# Altium schematic sheet mcu.SCHDOC: LiveDesign Evaluation - Video Games
size B; Organization: Altium Limited; Address1: L3, 12a Rodborough Rd; Address2: Frenchs Forest; Address3: NSW; Address4: Australia 2086; DocumentNumber: 2; SheetNumber: 2; SheetTotal: 13
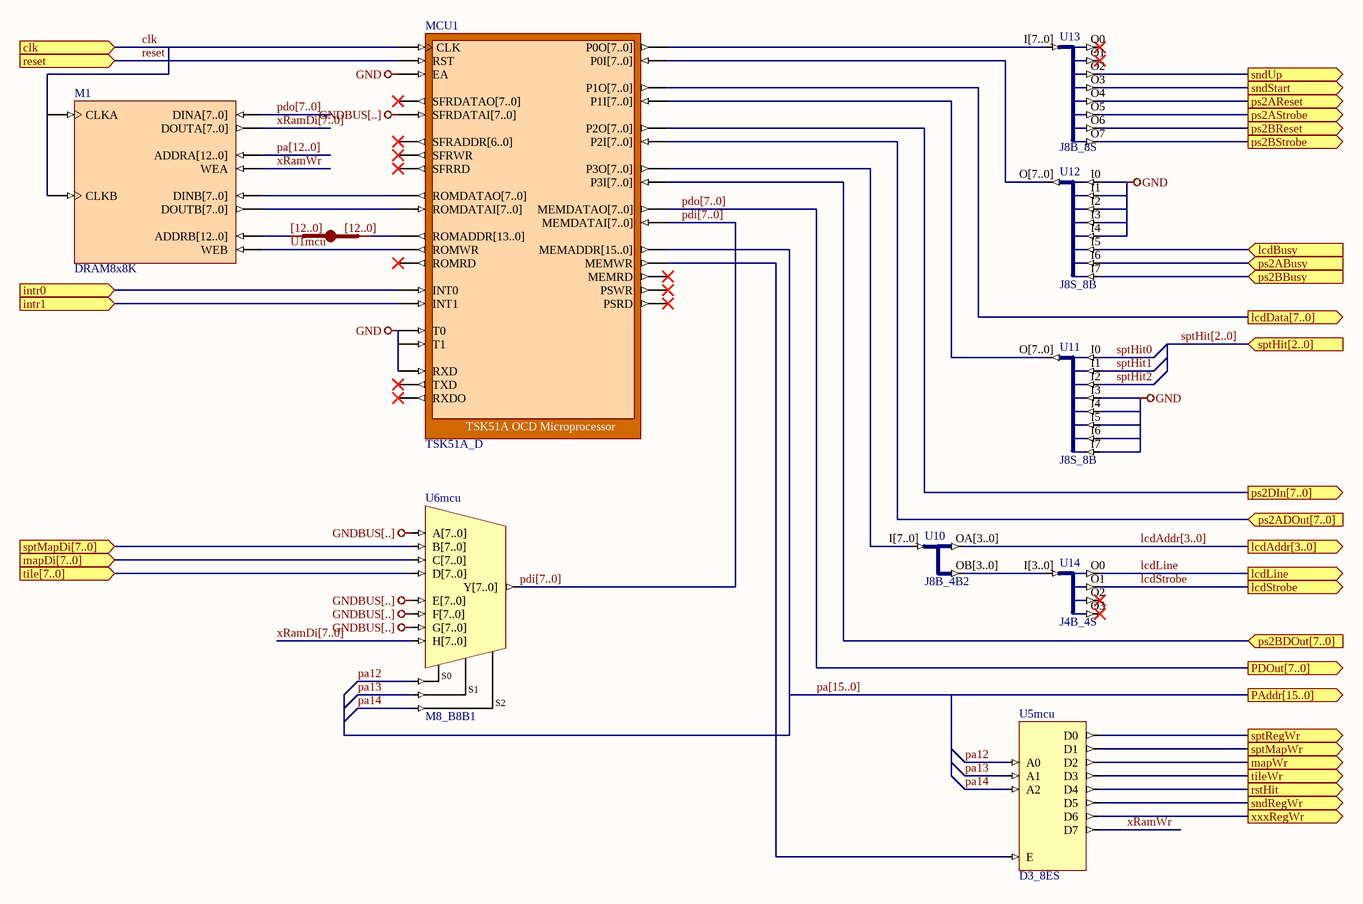
[diagram p0: mcu.SCHDOC]

## Parts
M1  DRAM8x8K
MCU1  TSK51A_D
U1mcu  IndexA: [12..0]  (hidden comment: JB)
U5mcu  D3_8ES
U6mcu  M8_B8B1
U10  J8B_4B2
U11  J8S_8B
U12  J8S_8B
U13  J8B_8S
U14  J4B_4S

## Ports
clk (in), intr0 (in), intr1 (in), lcdAddr[3..0] (out), lcdBusy (in), lcdData[7..0] (out), lcdLine (out), lcdStrobe (out), mapDi[7..0] (in), mapWr (out), PAddr[15..0] (out), PDOut[7..0] (out), ps2ABusy (in), ps2ADOut[7..0] (in), ps2AReset (out), ps2AStrobe (out), ps2BBusy (in), ps2BDOut[7..0] (in), ps2BReset (out), ps2BStrobe (out), ps2DIn[7..0] (out), reset (in), rstHit (out), sndRegWr (out), sndStart (out), sndUp (out), sptHit[2..0] (in), sptMapDi[7..0] (in), sptMapWr (out), sptRegWr (out), tile[7..0] (in), tileWr (out), xxxRegWr (out)

## Nets
GND: MCU1.EA MCU1.RXD MCU1.T0 MCU1.T1 U11.I3 U11.I4 U11.I5 U11.I6 U11.I7 U12.I0 U12.I1 U12.I2 U12.I3 U12.I4
GNDBUS[..]: MCU1.SFRDATAI[7..0] U6mcu.A[7..0] U6mcu.E[7..0] U6mcu.F[7..0] U6mcu.G[7..0]
clk: M1.CLKA M1.CLKB MCU1.CLK ; port clk
intr0: MCU1.INT0 ; port intr0
intr1: MCU1.INT1 ; port intr1
lcdAddr[3..0]: U10.OA[3..0] ; port lcdAddr[3..0]
lcdBusy: U12.I5 ; port lcdBusy
lcdData[7..0]: MCU1.P1O[7..0] ; port lcdData[7..0]
lcdLine: U14.O0 ; port lcdLine
lcdStrobe: U14.O1 ; port lcdStrobe
mapDi[7..0]: U6mcu.C[7..0] ; port mapDi[7..0]
mapWr: U5mcu.D2 ; port mapWr
pa12: U5mcu.A0 U6mcu.S0
pa13: U5mcu.A1 U6mcu.S1
pa14: U5mcu.A2 U6mcu.S2
pa[12..0]: M1.ADDRA[12..0]
pa[15..0]: MCU1.MEMADDR[15..0] ; port PAddr[15..0]
pdi[7..0]: MCU1.MEMDATAI[7..0] U6mcu.Y[7..0]
pdo[7..0]: M1.DINA[7..0] MCU1.MEMDATAO[7..0] ; port PDOut[7..0]
ps2ABusy: U12.I6 ; port ps2ABusy
ps2ADOut[7..0]: MCU1.P2I[7..0] ; port ps2ADOut[7..0]
ps2AReset: U13.O4 ; port ps2AReset
ps2AStrobe: U13.O5 ; port ps2AStrobe
ps2BBusy: U12.I7 ; port ps2BBusy
ps2BDOut[7..0]: MCU1.P3I[7..0] ; port ps2BDOut[7..0]
ps2BReset: U13.O6 ; port ps2BReset
ps2BStrobe: U13.O7 ; port ps2BStrobe
ps2DIn[7..0]: MCU1.P2O[7..0] ; port ps2DIn[7..0]
reset: MCU1.RST ; port reset
rstHit: U5mcu.D4 ; port rstHit
sndRegWr: U5mcu.D5 ; port sndRegWr
sndStart: U13.O3 ; port sndStart
sndUp: U13.O2 ; port sndUp
sptHit0: U11.I0
sptHit1: U11.I1
sptHit2: U11.I2
sptMapDi[7..0]: U6mcu.B[7..0] ; port sptMapDi[7..0]
sptMapWr: U5mcu.D1 ; port sptMapWr
sptRegWr: U5mcu.D0 ; port sptRegWr
tile[7..0]: U6mcu.D[7..0] ; port tile[7..0]
tileWr: U5mcu.D3 ; port tileWr
xRamDi[7..0]: M1.DOUTA[7..0] U6mcu.H[7..0]
xRamWr: M1.WEA U5mcu.D7
xxxRegWr: U5mcu.D6 ; port xxxRegWr
NetM1_ADDRB[12..0]: M1.ADDRB[12..0] U1mcu.A[0..0]
NetM1_DINB[7..0]: M1.DINB[7..0] MCU1.ROMDATAO[7..0]
NetM1_DOUTB[7..0]: M1.DOUTB[7..0] MCU1.ROMDATAI[7..0]
NetM1_WEB: M1.WEB MCU1.ROMWR
NetMCU1_MEMWR: MCU1.MEMWR U5mcu.E
NetMCU1_P0I[7..0]: MCU1.P0I[7..0] U12.O[7..0]
NetMCU1_P0O[7..0]: MCU1.P0O[7..0] U13.I[7..0]
NetMCU1_P1I[7..0]: MCU1.P1I[7..0] U11.O[7..0]
NetMCU1_P3O[7..0]: MCU1.P3O[7..0] U10.I[7..0]
NetMCU1_ROMADDR[13..0]: MCU1.ROMADDR[13..0] U1mcu.B[0..0]
NetU10_OB[3..0]: U10.OB[3..0] U14.I[3..0]

Not connected (* = marked no-connect by the designer): MCU1 MEMRD* PSRD* PSWR* ROMRD* RXDO* SFRADDR[6..0]* SFRDATAO[7..0]* SFRRD* SFRWR* TXD*; U13 O0* O1*; U14 O2* O3*

## Buses and harness runs
bus lcdAddr[3..0] = port lcdAddr[3..0]
bus pa[12..0]
bus pa[15..0] = port PAddr[15..0]
bus pdi[7..0]
bus pdo[7..0]
bus pdo[7..0] = port PDOut[7..0]
bus sptHit[2..0] = port sptHit[2..0]
bus xRamDi[7..0]

## Notes on the sheet
- Title
- Size:
- Date:
- B
- Number:
- Time:
- Revision:
- Sheet
- of
- File:

## Library data of the parts
M1 = DRAM8x8K: Dual Port Random Access Memory 8192 x 8 and 8192 x 8; Memory_DepthA: 8192; Memory_Type: RAM_DualPortBlock; Memory_WidthA: 8; Memory_ClockEdge: Rising; Nexus_Core: Memory_Program; Published: 26/09/2003; Publisher: Altium Hobart Technology Center; Memory_DepthB: 8192; Memory_WidthB: 8
MCU1 = TSK51A_D: TSK51A OCD Microprocessor; NEXUS_CORE: Processor_OCDS; NEXUS_JTAG_DEVICE: True; NEXUS_JTAG_ORDER: 0; ChildModel1: RAM256x8_TSK51D; ChildCore1: M1; Memory_Configuration: Record[NEXUS_CORE]{}ComponentDesignator[iram]{}Memory_Depth[256]{}Memory_UsageType[ram]{}ProgramDownloadAddress[0x0]{}Memory_BusType[c51:idata_bus]{n}Record[NEXUS_CORE]{}ComponentDesignator[xram]{}Memory_Depth[1536]{}Memory_UsageType[ram]{}ProgramDownloadAddress[0x7A00]{}Memory_BusType[c51:xdata_bus]{n}Record[NEXUS_CORE]{}ComponentDesignator[xrom]{}Memory_Depth[6556]{}Memory_UsageType[rom]{}ProgramDownloadAddress[0x0]{}Memory_BusType[c51:code_bus]{n}; Published: 23/10/2003; Publisher: Altium Hobart Technology Centre; Core Revision: 1.00.00
U1mcu = JB: System BUS Joiner; ArchiveName: GENERIC; Published: 18-Dec-2003; Publisher: Altium Limited; Core Revision: 1.00.00; IndexB: [12..0]
U5mcu = D3_8ES: Binary 3- to 8-Bit Decoder with Enable, Single Pin Version; Xilinx Equivalent: D3_8E; ArchiveName: GENERIC; Published: 9-30-2003; Publisher: Altium Limited; Core Revision: 1.00.00
U6mcu = M8_B8B1: 8x8-Bit Bus to 1x8-Bit Bus Multiplexer; ArchiveName: GENERIC; Published: 9-30-2003; Publisher: Altium Limited; Core Revision: 1.00.00
U10 = J8B_4B2: 1 x 8-bit input bus to 2 x 4-Bit output bus; ArchiveName: GENERIC; Published: 18-Dec-2003; Publisher: Altium Limited; Core Revision: 1.00.00
U11 U12 = J8S_8B: 8 Single pin inputs to single 8-Bit output bus; ArchiveName: GENERIC; Published: 18-Dec-2003; Publisher: Altium Limited; Core Revision: 1.00.00
U13 = J8B_8S: 8-Bit input bus to 8 single pin outputs; ArchiveName: GENERIC; Published: 18-Dec-2003; Publisher: Altium Limited; Core Revision: 1.00.00
U14 = J4B_4S: 4-Bit input bus to 4 Single pin outputs; ArchiveName: GENERIC; Published: 18-Dec-2003; Publisher: Altium Limited; Core Revision: 1.00.00